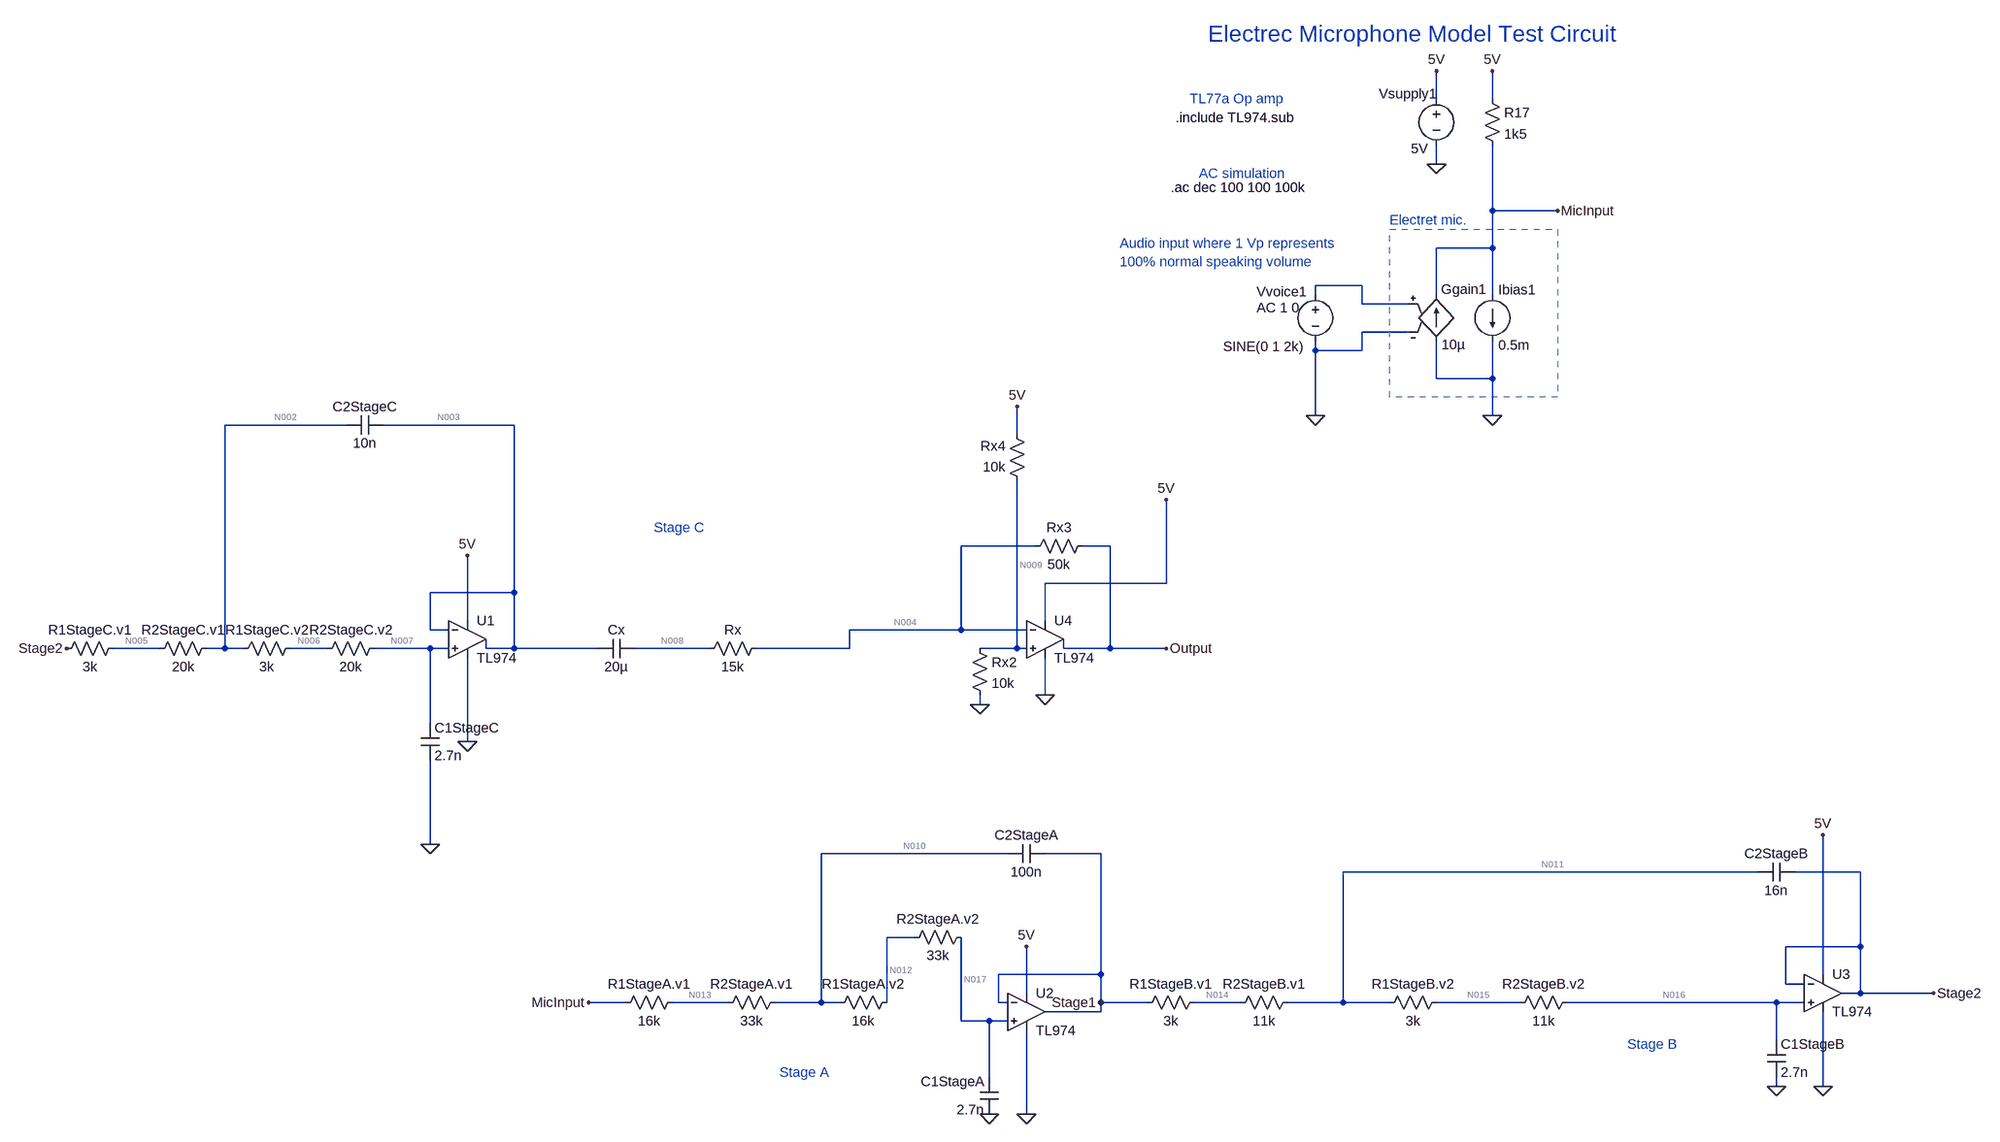
[diagram p0: schematic EGB240v1.asc]
EGB240v1.asc, the LTspice schematic file:
Version 4
SHEET 1 1588 1652
WIRE -96 -992 -96 -1040
WIRE 0 -992 0 -1040
WIRE -96 -880 -96 -912
WIRE 0 -800 0 -912
WIRE 112 -800 0 -800
WIRE 0 -736 0 -800
WIRE 0 -736 -96 -736
WIRE -224 -672 -304 -672
WIRE -304 -656 -304 -672
WIRE -96 -656 -96 -736
WIRE 0 -656 0 -736
WIRE -224 -640 -224 -672
WIRE -144 -640 -224 -640
WIRE -144 -592 -224 -592
WIRE -304 -560 -304 -576
WIRE -224 -560 -224 -592
WIRE -224 -560 -304 -560
WIRE -96 -512 -96 -576
WIRE 0 -512 0 -576
WIRE 0 -512 -96 -512
WIRE -304 -448 -304 -560
WIRE 0 -448 0 -512
WIRE -1968 -432 -2176 -432
WIRE -1680 -432 -1904 -432
WIRE -816 -416 -816 -464
WIRE -784 -224 -912 -224
WIRE -656 -224 -704 -224
WIRE -560 -160 -560 -304
WIRE -560 -160 -768 -160
WIRE -1680 -144 -1680 -432
WIRE -1680 -144 -1824 -144
WIRE -1760 -96 -1760 -208
WIRE -768 -96 -768 -160
WIRE -1824 -80 -1824 -144
WIRE -1792 -80 -1824 -80
WIRE -912 -80 -912 -224
WIRE -912 -80 -1104 -80
WIRE -800 -80 -912 -80
WIRE -2288 -48 -2368 -48
WIRE -2176 -48 -2176 -432
WIRE -2176 -48 -2208 -48
WIRE -2144 -48 -2176 -48
WIRE -2000 -48 -2064 -48
WIRE -1824 -48 -1920 -48
WIRE -1792 -48 -1824 -48
WIRE -1728 -48 -1728 -64
WIRE -1680 -48 -1680 -144
WIRE -1680 -48 -1728 -48
WIRE -1536 -48 -1680 -48
WIRE -1344 -48 -1472 -48
WIRE -1104 -48 -1104 -80
WIRE -1104 -48 -1264 -48
WIRE -816 -48 -816 -336
WIRE -816 -48 -880 -48
WIRE -800 -48 -816 -48
WIRE -736 -48 -736 -64
WIRE -656 -48 -656 -224
WIRE -656 -48 -736 -48
WIRE -560 -48 -656 -48
WIRE -768 32 -768 -32
WIRE -880 48 -880 32
WIRE -1824 80 -1824 -48
WIRE -1760 112 -1760 -32
WIRE -1824 288 -1824 144
WIRE -832 304 -1152 304
WIRE -672 304 -768 304
WIRE 464 336 -256 336
WIRE 640 336 528 336
WIRE -992 448 -1040 448
WIRE 640 464 640 336
WIRE 640 464 512 464
WIRE -672 512 -672 304
WIRE -672 512 -848 512
WIRE 576 512 576 272
WIRE 512 528 512 464
WIRE 544 528 512 528
WIRE -800 544 -800 464
WIRE 640 544 640 464
WIRE 640 544 608 544
WIRE 784 544 640 544
WIRE -1488 560 -1552 560
WIRE -1312 560 -1408 560
WIRE -1152 560 -1152 304
WIRE -1152 560 -1232 560
WIRE -1120 560 -1152 560
WIRE -1040 560 -1040 448
WIRE -848 560 -848 512
WIRE -832 560 -848 560
WIRE -672 560 -672 512
WIRE -592 560 -672 560
WIRE -432 560 -512 560
WIRE -256 560 -256 336
WIRE -256 560 -352 560
WIRE -176 560 -256 560
WIRE 48 560 -96 560
WIRE 496 560 128 560
WIRE 544 560 496 560
WIRE -672 576 -672 560
WIRE -672 576 -768 576
WIRE -912 592 -912 448
WIRE -864 592 -912 592
WIRE -832 592 -864 592
WIRE 496 624 496 560
WIRE -864 688 -864 592
WIRE 496 704 496 688
WIRE 576 704 576 576
WIRE -800 752 -800 608
FLAG -1824 288 0
FLAG -1760 112 0
FLAG -880 48 0
FLAG -768 32 0
FLAG -864 752 0
FLAG -800 752 0
FLAG 496 704 0
FLAG 576 704 0
FLAG 0 -448 0
FLAG -304 -448 0
FLAG -96 -880 0
FLAG -816 -464 5V
FLAG -800 464 5V
FLAG 576 272 5V
FLAG -1760 -208 5V
FLAG -2448 -48 Stage2
FLAG 784 544 Stage2
FLAG -1552 560 MicInput
FLAG 112 -800 MicInput
FLAG -672 560 Stage1
FLAG -96 -1040 5V
FLAG 0 -1040 5V
FLAG -560 -304 5V
FLAG -560 -48 Output
SYMBOL res -2352 -64 R90
WINDOW 0 0 56 VBottom 2
WINDOW 3 32 56 VTop 2
SYMATTR InstName R1StageC.v1
SYMATTR Value 3k
SYMBOL res -2192 -64 R90
WINDOW 0 0 56 VBottom 2
WINDOW 3 32 56 VTop 2
SYMATTR InstName R2StageC.v1
SYMATTR Value 20k
SYMBOL res -2048 -64 R90
WINDOW 0 0 56 VBottom 2
WINDOW 3 32 56 VTop 2
SYMATTR InstName R1StageC.v2
SYMATTR Value 3k
SYMBOL res -1904 -64 R90
WINDOW 0 0 56 VBottom 2
WINDOW 3 32 56 VTop 2
SYMATTR InstName R2StageC.v2
SYMATTR Value 20k
SYMBOL cap -1904 -448 R90
WINDOW 0 0 32 VBottom 2
WINDOW 3 32 32 VTop 2
SYMATTR InstName C2StageC
SYMATTR Value 10n
SYMBOL cap -848 752 R180
WINDOW 0 24 56 Left 2
WINDOW 3 24 8 Left 2
SYMATTR InstName C1StageA
SYMATTR Value 2.7n
SYMBOL cap -832 320 R270
WINDOW 0 32 32 VTop 2
WINDOW 3 0 32 VBottom 2
SYMATTR InstName C2StageA
SYMATTR Value 100n
SYMBOL cap 528 320 R90
WINDOW 0 0 32 VBottom 2
WINDOW 3 32 32 VTop 2
SYMATTR InstName C2StageB
SYMATTR Value 16n
SYMBOL OpAmps\\opamp2 -1760 -128 R0
SYMATTR InstName U1
SYMATTR Value TL974
SYMBOL OpAmps\\opamp2 -800 512 R0
SYMATTR InstName U2
SYMATTR Value TL974
SYMBOL OpAmps\\opamp2 576 480 R0
SYMATTR InstName U3
SYMATTR Value TL974
SYMBOL OpAmps\\opamp2 -768 -128 R0
SYMATTR InstName U4
SYMATTR Value TL974
SYMBOL cap -1472 -64 R90
WINDOW 0 0 32 VBottom 2
WINDOW 3 32 32 VTop 2
SYMATTR InstName Cx
SYMATTR Value 20µ
SYMBOL res -1248 -64 R90
WINDOW 0 0 56 VBottom 2
WINDOW 3 32 56 VTop 2
SYMATTR InstName Rx
SYMATTR Value 15k
SYMBOL res -896 -64 R0
SYMATTR InstName Rx2
SYMATTR Value 10k
SYMBOL res -688 -240 R90
WINDOW 0 0 56 VBottom 2
WINDOW 3 32 56 VTop 2
SYMATTR InstName Rx3
SYMATTR Value 50k
SYMBOL res -800 -320 R180
WINDOW 0 36 76 Left 2
WINDOW 3 36 40 Left 2
SYMATTR InstName Rx4
SYMATTR Value 10k
SYMBOL res -1392 544 R90
WINDOW 0 0 56 VBottom 2
WINDOW 3 32 56 VTop 2
SYMATTR InstName R1StageA.v1
SYMATTR Value 16k
SYMBOL res -1216 544 R90
WINDOW 0 0 56 VBottom 2
WINDOW 3 32 56 VTop 2
SYMATTR InstName R2StageA.v1
SYMATTR Value 33k
SYMBOL res -1024 544 R90
WINDOW 0 0 56 VBottom 2
WINDOW 3 32 56 VTop 2
SYMATTR InstName R1StageA.v2
SYMATTR Value 16k
SYMBOL res -896 432 R90
WINDOW 0 0 56 VBottom 2
WINDOW 3 32 56 VTop 2
SYMATTR InstName R2StageA.v2
SYMATTR Value 33k
SYMBOL res -496 544 R90
WINDOW 0 0 56 VBottom 2
WINDOW 3 32 56 VTop 2
SYMATTR InstName R1StageB.v1
SYMATTR Value 3k
SYMBOL res -336 544 R90
WINDOW 0 0 56 VBottom 2
WINDOW 3 32 56 VTop 2
SYMATTR InstName R2StageB.v1
SYMATTR Value 11k
SYMBOL res -80 544 R90
WINDOW 0 0 56 VBottom 2
WINDOW 3 32 56 VTop 2
SYMATTR InstName R1StageB.v2
SYMATTR Value 3k
SYMBOL res 144 544 R90
WINDOW 0 0 56 VBottom 2
WINDOW 3 32 56 VTop 2
SYMATTR InstName R2StageB.v2
SYMATTR Value 11k
SYMBOL cap 480 624 R0
SYMATTR InstName C1StageB
SYMATTR Value 2.7n
SYMBOL g -96 -672 R0
WINDOW 0 8 7 Left 2
WINDOW 3 9 102 Left 2
SYMATTR InstName Ggain1
SYMATTR Value 10µ
SYMBOL current 0 -656 R0
WINDOW 0 10 -8 Left 2
WINDOW 3 10 87 Left 2
WINDOW 123 0 0 Left 0
WINDOW 39 0 0 Left 0
SYMATTR InstName Ibias1
SYMATTR Value 0.5m
SYMBOL res -16 -1008 R0
SYMATTR InstName R17
SYMATTR Value 1k5
SYMBOL voltage -304 -672 R0
WINDOW 0 -101 11 Left 2
WINDOW 3 -158 105 Left 2
WINDOW 123 -101 39 Left 2
WINDOW 39 0 0 Left 0
SYMATTR InstName Vvoice1
SYMATTR Value SINE(0 1 2k)
SYMATTR Value2 AC 1 0
SYMBOL voltage -96 -1008 R0
WINDOW 0 -99 7 Left 2
WINDOW 3 -44 101 Left 2
WINDOW 123 0 0 Left 0
WINDOW 39 0 0 Left 0
SYMATTR InstName Vsupply1
SYMATTR Value 5V
SYMBOL cap -1840 80 R0
SYMATTR InstName C1StageC
SYMATTR Value 2.7n
TEXT -1224 680 Left 2 ;Stage A
TEXT 232 632 Left 2 ;Stage B
TEXT -1440 -256 Left 2 ;Stage C
TEXT -488 -1104 Left 4 ;Electrec Microphone Model Test Circuit
TEXT -640 -744 Left 2 ;Audio input where 1 Vp represents \n100% normal speaking volume
TEXT -176 -784 Left 2 ;Electret mic.
TEXT -544 -960 Left 2 !.include TL974.sub
TEXT -520 -992 Left 2 ;TL77a Op amp
TEXT -552 -840 Left 2 !.ac dec 100 100 100k
TEXT -504 -864 Left 2 ;AC simulation
RECTANGLE Normal 112 -480 -176 -768 2

The netlist it stands for:
* EGB240v1.asc
R1StageC.v1 N005 Stage2 3k
R2StageC.v1 N002 N005 20k
R1StageC.v2 N006 N002 3k
R2StageC.v2 N007 N006 20k
C2StageC N003 N002 10n
C1StageA 0 N017 2.7n
C2StageA N010 Stage1 100n
C2StageB Stage2 N011 16n
XU1 N007 N003 5V 0 N003 TL974  ; pins In+ In- V+ V- OUT
XU2 N017 Stage1 5V 0 Stage1 TL974  ; pins In+ In- V+ V- OUT
XU3 N016 Stage2 5V 0 Stage2 TL974  ; pins In+ In- V+ V- OUT
XU4 N009 N004 5V 0 Output TL974  ; pins In+ In- V+ V- OUT
Cx N008 N003 20µ
Rx N004 N008 15k
Rx2 N009 0 10k
Rx3 Output N004 50k
Rx4 N009 5V 10k
R1StageA.v1 N013 MicInput 16k
R2StageA.v1 N010 N013 33k
R1StageA.v2 N012 N010 16k
R2StageA.v2 N017 N012 33k
R1StageB.v1 N014 Stage1 3k
R2StageB.v1 N011 N014 11k
R1StageB.v2 N015 N011 3k
R2StageB.v2 N016 N015 11k
C1StageB N016 0 2.7n
Ggain1 0 MicInput N001 0 10µ
Ibias1 MicInput 0 0.5m
R17 5V MicInput 1k5
Vvoice1 N001 0 SINE(0 1 2k) AC 1 0
Vsupply1 5V 0 5V
C1StageC N007 0 2.7n
* Stage A
* Stage B
* Stage C
* Electrec Microphone Model Test Circuit
* Audio input where 1 Vp represents
* 100% normal speaking volume
* Electret mic.
.include TL974.sub
* TL77a Op amp
.ac dec 100 100 100k
* AC simulation
.backanno
.end

* Results of the author's LTspice run, read from the files saved beside the schematic
* Operating Point, zero values left out:
*   V(n005) = 3.662 V
*   V(stage2) = 3.663 V
*   V(n002) = 3.653 V
*   V(n006) = 3.652 V
*   V(n007) = 3.644 V
*   V(n003) = 3.642 V
*   V(n017) = 3.701 V
*   V(n010) = 3.971 V
*   V(stage1) = 3.699 V
*   V(n011) = 3.682 V
*   V(5v) = 5 V
*   V(n016) = 3.665 V
*   V(n009) = 2.501 V
*   V(n004) = 2.5 V
*   V(output) = 2.49 V
*   V(n008) = 2.5 V
*   V(n013) = 4.153 V
*   V(micinput) = 4.242 V
*   V(n012) = 3.883 V
*   V(n014) = 3.695 V
*   V(n015) = 3.678 V
*   I(Ibias1) = 500 µA
*   I(R17) = 505.5 µA
*   I(R2stageb.v2) = -1.211 µA
*   I(R1stageb.v2) = -1.211 µA
*   I(R2stageb.v1) = -1.211 µA
*   I(R1stageb.v1) = -1.211 µA
*   I(R2stagea.v2) = -5.518 µA
*   I(R1stagea.v2) = -5.518 µA
*   I(R2stagea.v1) = -5.518 µA
*   I(R1stagea.v1) = -5.518 µA
*   I(Rx4) = -249.9 µA
*   I(Rx3) = -200 nA
*   I(Rx2) = 250.1 µA
*   I(R2stagec.v2) = -415.3 nA
*   I(R1stagec.v2) = -415.3 nA
*   I(R2stagec.v1) = -415.3 nA
*   I(R1stagec.v1) = -415.3 nA
*   I(Vsupply1) = -8.74 mA
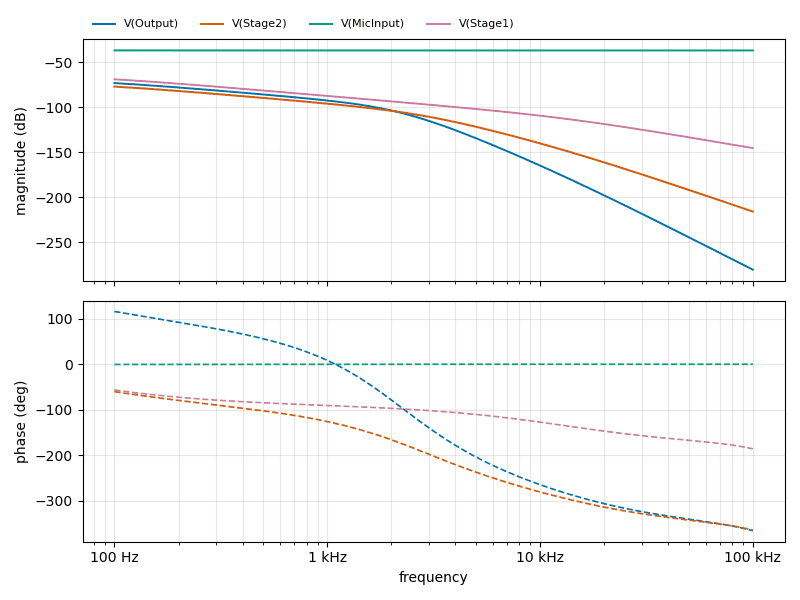
[diagram p1: AC Analysis of EGB240v1.asc, plotted from the saved traces]
* AC Analysis, 1 run:
*   V(Output): -73.02 dB at 100 Hz, -280.41 dB at 100 kHz, peak -73.02 dB at 100 Hz, 3 dB below the peak at 156.2 Hz
*   V(Stage2): -76.93 dB at 100 Hz, -215.78 dB at 100 kHz, peak -76.93 dB at 100 Hz, 3 dB below the peak at 156.3 Hz
*   V(MicInput): -36.70 dB at 100 Hz, -36.74 dB at 100 kHz, peak -36.70 dB at 100 Hz
*   V(Stage1): -68.83 dB at 100 Hz, -145.27 dB at 100 kHz, peak -68.83 dB at 100 Hz, 3 dB below the peak at 156.4 Hz